# EAGLE design ESPMDIR (EAGLE 7.7.0)
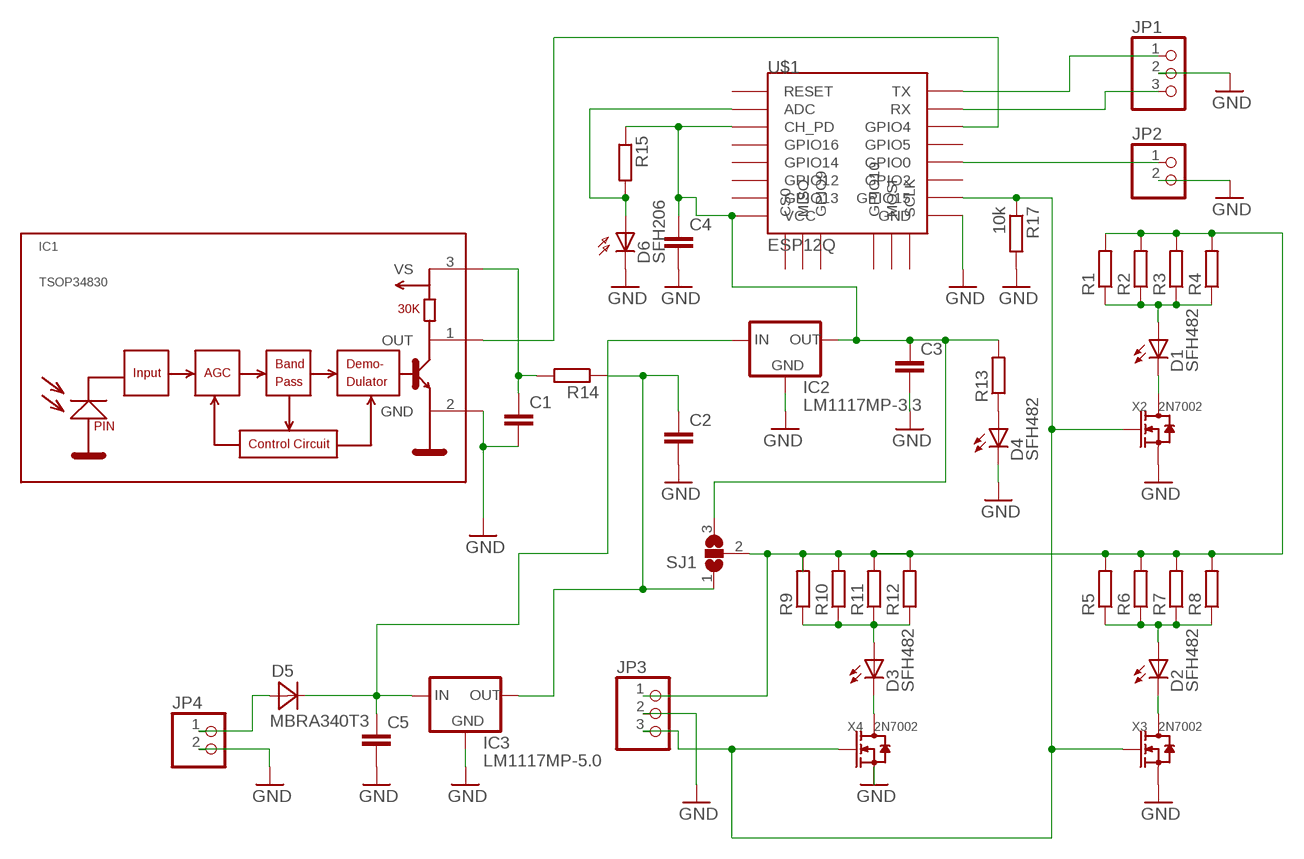
[diagram p0: schematic, sheet 1]

## Parts
C1  C-EUC4532  [C4532]
C2  C-EUC4532  [C4532]
C3  C-EUC4532  [C4532]
C4  C-EUC0805  [C0805]
C5  C-EUC4532  [C4532]
D1  SFH482  [SFH482]
D2  SFH482  [SFH482]
D3  SFH482  [SFH482]
D4  SFH482  [SFH482]
D5  MBRA340T3  [SMA]
D6  SFH206  [SFH206]
IC1  TSOP34830  [TSOP348]
IC2  LM1117MP-3.3  [SOT223]
IC3  LM1117MP-5.0  [SOT223]
JP1  PINHD-1X3  [1X03]
JP2  PINHD-1X2  [1X02]
JP3  PINHD-1X3  [1X03]
JP4  PINHD-1X2  [1X02]
R1  R-EU_R0805  [R0805]
R2  R-EU_R0805  [R0805]
R3  R-EU_R0805  [R0805]
R4  R-EU_R0805  [R0805]
R5  R-EU_R0805  [R0805]
R6  R-EU_R0805  [R0805]
R7  R-EU_R0805  [R0805]
R8  R-EU_R0805  [R0805]
R9  R-EU_R0805  [R0805]
R10  R-EU_R0805  [R0805]
R11  R-EU_R0805  [R0805]
R12  R-EU_R0805  [R0805]
R13  R-EU_R0805  [R0805]
R14  R-EU_R0805  [R0805]
R15  R-EU_R0805  [R0805]
R17  10k  R-EU_R0805  [R0805]
SJ1  SJ2W  [SJ_2]
U$1  ESP12Q  [ESP12Q]
X2  2N7002  SMD-MOSFET-N-CH-60V-300MA-LOGIC-LEVEL-FET-2N7002(SOT-23)  [SOT-23]
X3  2N7002  SMD-MOSFET-N-CH-60V-300MA-LOGIC-LEVEL-FET-2N7002(SOT-23)  [SOT-23]
X4  2N7002  SMD-MOSFET-N-CH-60V-300MA-LOGIC-LEVEL-FET-2N7002(SOT-23)  [SOT-23]

## Nets
N$1: D1.K(C) X2.3(D)
N$2: R9.2 R10.2 R11.2 R12.2
N$3: D3.A R9.1 R10.1 R11.1 R12.1
N$4: D2.K(C) X3.3(D)
N$5: C3.1 C4.1 IC2.2(OUT) IC2.4(OUT) R13.2 R15.1 SJ1.3 U$1.CH_PD U$1.VCC
N$6: D1.A R1.1 R2.1 R3.1 R4.1
N$7: D2.A R5.1 R6.1 R7.1 R8.1
N$8: D3.K(C) X4.3(D)
N$9: JP3.3 R17.1 U$1.GPIO15 X2.1(G) X3.1(G) X4.1(G)
N$10: C2.1 IC3.2(OUT) IC3.4(OUT) R14.1 SJ1.1
N$11: JP1.1 U$1.TX
N$12: JP3.1 R1.2 R2.2 R3.2 R4.2 R5.2 R6.2 R7.2 R8.2 SJ1.2
N$13: JP1.3 U$1.RX
N$14: JP2.1 U$1.GPIO0
N$15: D4.A R13.1
N$16: C1.1 IC1.3(VS) R14.2
N$17: IC1.1(OUT) U$1.GPIO4
N$19: C1.2 C2.2 C3.2 C4.2 C5.2 D4.K(C) D6.K(C) IC1.2(GND) IC2.1(GND) IC3.1(GND) JP1.2 JP2.2 JP3.2 JP4.2 R17.2 U$1.GND X2.2(S) X3.2(S) X4.2(S) ; supply symbol labelled GND
N$27: D5.A JP4.1
N$29: C5.1 D5.C IC2.3(IN) IC3.3(IN)
N$33: D6.A R15.2 U$1.ADC
Unconnected: U$1.CS0 U$1.GPIO2 U$1.GPIO5 U$1.GPIO9 U$1.GPIO10 U$1.GPIO12 U$1.GPIO13 U$1.GPIO14 U$1.GPIO16 U$1.MISO U$1.MOSI U$1.RESET U$1.SCLK

## Library data of the parts
C1-C5 = rcl:C-EU: CAPACITOR, European symbol
D1-D4 = led:SFH482: IR LED infrared emitting diode, Infineon
D5 = diode:MBRA340T3: Surface Mount Schottky Power Rectifier Source: http://www.onsemi.com/pub_link/Collateral/MBRA340T3-D.PDF
D6 = opto-trans-siemens:SFH206: PHOTO DIODE; MPN: SFH206K; OC_FARNELL: 1212741; OC_NEWARK: 01M8807
IC1 = vishay-1:TSOP348*: IR Receiver Modules for Remote Control Systems http://www.vishay.com/ir-receiver-modules/
IC2 = lm1117_11:LM1117?-*: 800mA Low-Dropout Linear Regulator Source: http://www.ti.com/lit/ds/symlink/lm1117-n.pdf; MF: Texas Instruments; MPN: LM1117MP-3.3; OC_FARNELL: 9778195; OC_NEWARK: 28X3416
IC3 = lm1117_11:LM1117?-*: 800mA Low-Dropout Linear Regulator Source: http://www.ti.com/lit/ds/symlink/lm1117-n.pdf; MF: Texas Instruments; MPN: LM1117MP-5.0; OC_FARNELL: 9778209; OC_NEWARK: 28X3417
JP1 JP3 = pinhead:PINHD-1X3: PIN HEADER
JP2 JP4 = pinhead:PINHD-1X2: PIN HEADER
R1-R15 R17 = rcl:R-EU_: RESISTOR, European symbol
SJ1 = jumper:SJ2W: SMD solder JUMPER
U$1 = esp826612q:ESP12Q: ESP8266 Wifi module 12-Q
X2-X4 = Seeed-OPL-Transistor:SMD-MOSFET-N-CH-60V-300MA-LOGIC-LEVEL-FET-2N7002(SOT-23): 305030028; MPN: 2N7002,215

## Board
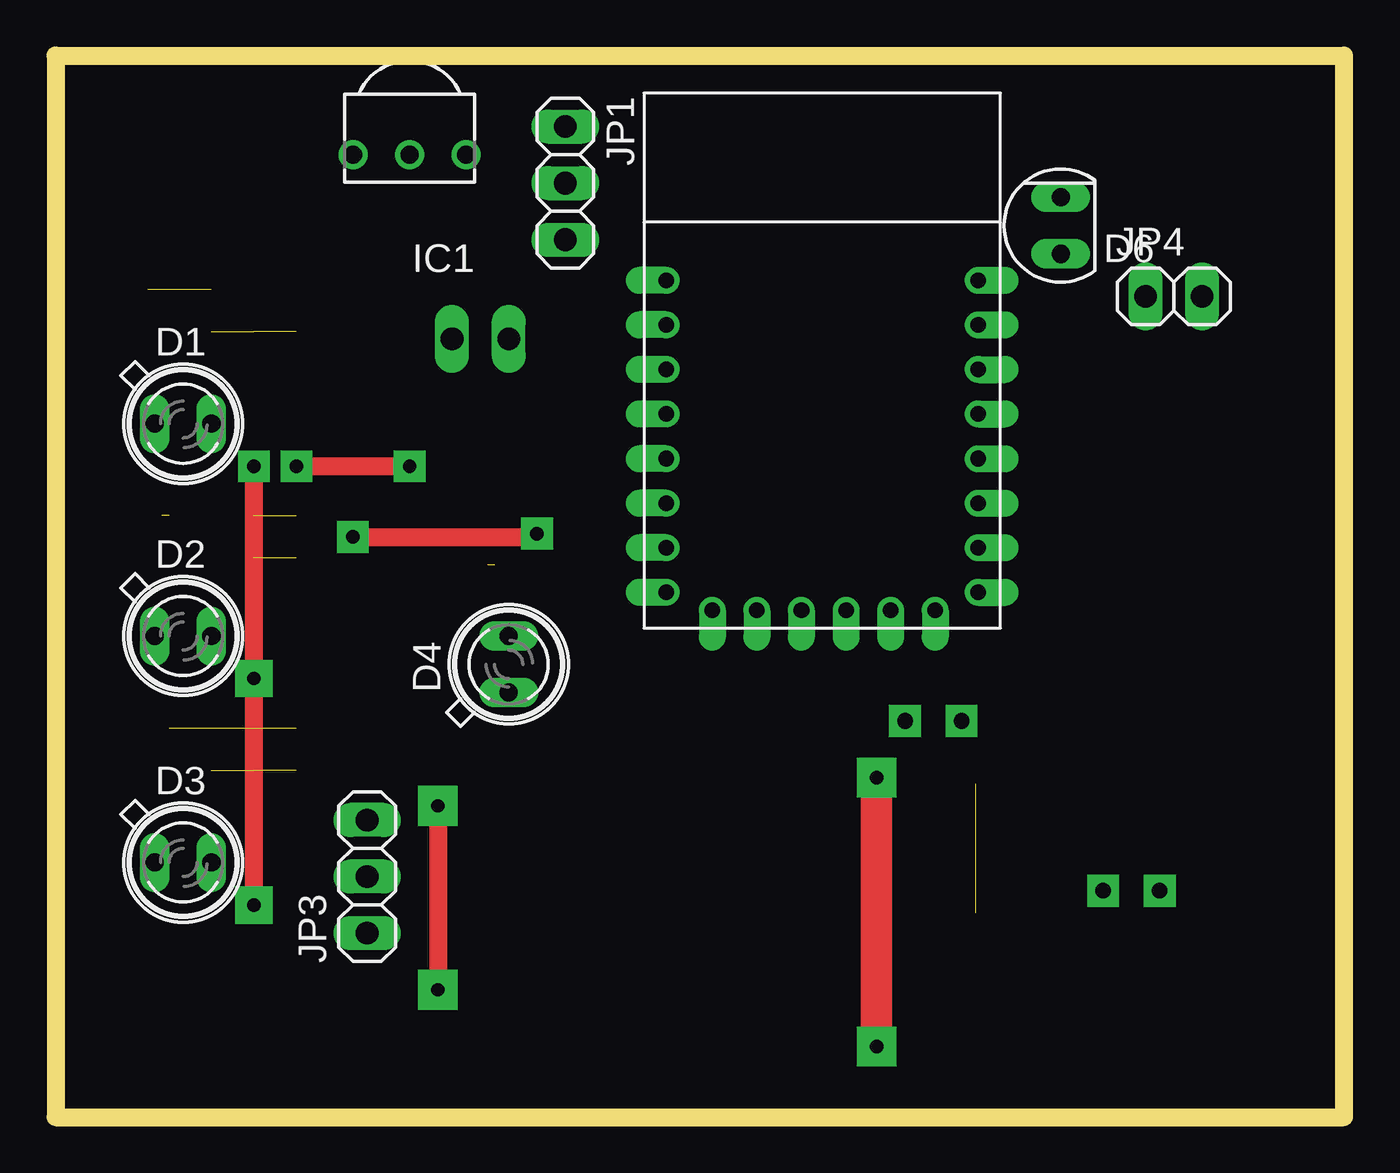
[diagram p1: board, top side]
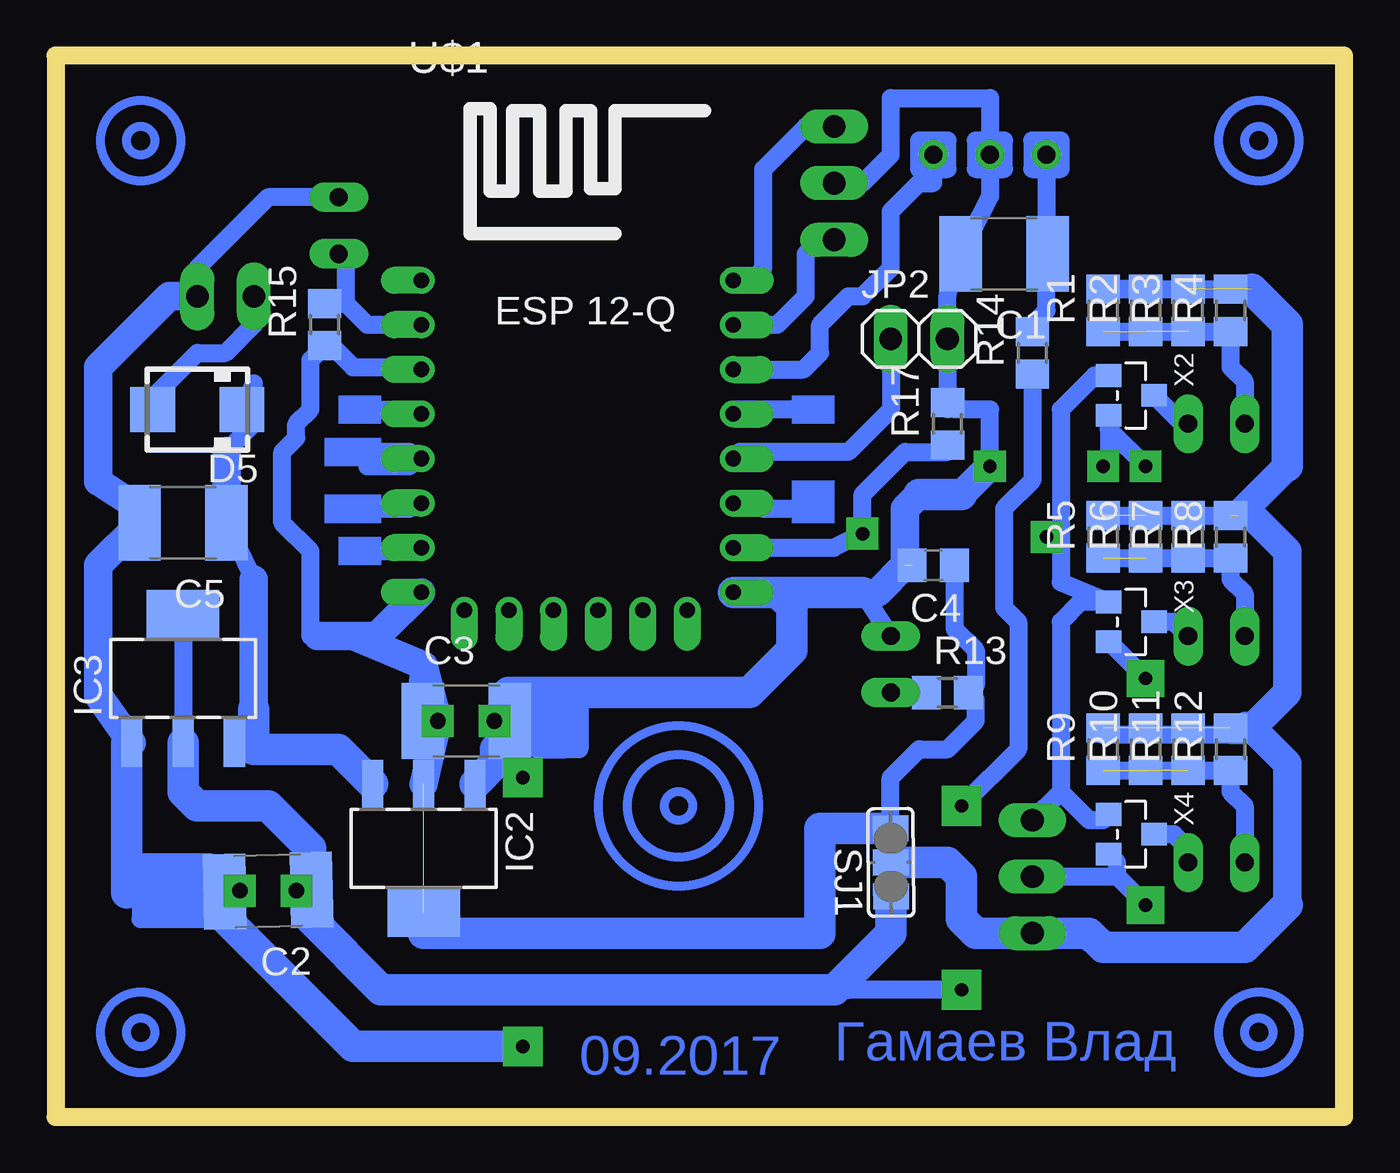
[diagram p2: board, bottom side, seen from below]

Size 57.79 x 47.62 mm. Coordinates in mm from the lower left corner, seen from the top.
Outline: 0,47.62 57.79,47.62 57.79,0 0,0 0,47.62
Copper layers (1*16): Top 0.035mm / dielectric 1.5mm / Bottom 0.035mm
Design rules "default *": minimum track width 32mil, minimum drill 24mil, track to track 24mil, track to pad 24mil, pad to pad 24mil, via to via 24mil, smd to smd 24mil, copper to edge 40mil, drill to drill 40mil, minimum pad ring 10mil, minimum via ring 8mil, stop-mask expansion 4mil, vias tented up to drill 0mil, thermal gap 10mil

### Footprints (pad centres in the part's own frame; a part is rotated, then mirrored left to right if it is on the bottom)
C4532 = smd 1.9 x 3.4: 1 -1.95,0; 2 1.95,0
C0805 = smd 1.3 x 1.5: 1 -0.95,0; 2 0.95,0
SFH482 = drill 0.813 long: A -1.27,0; K 1.27,0
SMA = smd 2 x 2: A 2,0; C -2,0
SFH206 = drill 0.813 long: A 0,-1.27; K 0,1.27
TSOP348 = drill 0.8: 1 -2.54,0; 2 0,0; 3 2.54,0
SOT223 = smd 0.95 x 2.15: 1 -2.3,-2.9; 2 0,-2.9; 3 2.3,-2.9 | smd 3.25 x 2.15: 4 0,2.9
1X03 = drill 1.016 long: 1 -2.54,0; 2 0,0; 3 2.54,0
1X02 = drill 1.016 long: 1 -1.27,0; 2 1.27,0
R0805 = smd 1.3 x 1.5: 1 -0.95,0; 2 0.95,0
SJ_2 = smd 1.168 x 1.6: 1 -1.524,0; 2 0,0; 3 1.524,0
ESP12Q = drill 0.7 offset: ADC -7.1,3.8; CH_PD -7.1,1.8; CS0 -5.165,-9.005; GND 6.9,-8.2; GPIO0 6.9,-2.2; GPIO2 6.9,-4.2; GPIO4 6.9,1.8; GPIO5 6.9,-0.2; GPIO9 -1.165,-9.005; GPIO10 0.835,-9.005; GPIO12 -7.1,-4.2; GPIO13 -7.1,-6.2; GPIO14 -7.1,-2.2; GPIO15 6.9,-6.2; GPIO16 -7.1,-0.2; MISO -3.165,-9.005; MOSI 2.835,-9.005; RESET -7.1,5.8; RX 6.9,3.8; SCLK 4.835,-9.005; TX 6.9,5.8; VCC -7.1,-8.2
SOT-23 = smd 1.016 x 1.143: 1 -0.889,-1.016; 2 0.889,-1.016; 3 0,1.016

### Placement (x,y rotation side)
C1  15.24,38.73 180 bottom
C2  48.26,10.16 181.2 bottom
C3  39.37,17.78 0 bottom
C4  18.41,24.76 180 bottom
C5  52.07,26.67 180 bottom
D1  5.72,31.11 0 top
D2  5.72,21.59 0 top
D3  5.72,11.43 0 top
D4  20.32,20.32 90 top
D5  51.44,31.75 180 bottom
D6  45.09,40 0 top
IC1  15.88,43.18 180 top
IC2  41.28,12.07 180 bottom
IC3  52.07,19.68 0 bottom
JP1  22.86,41.91 270 top
JP2  19.05,34.92 0 bottom
JP3  13.97,10.79 90 top
JP4  50.16,36.83 0 top
R1  10.79,36.19 90 bottom
R2  8.89,36.19 90 bottom
R3  6.99,36.19 90 bottom
R4  5.08,36.19 90 bottom
R5  10.79,26.04 90 bottom
R6  8.89,26.04 90 bottom
R7  6.99,26.04 90 bottom
R8  5.08,26.04 90 bottom
R9  10.79,16.51 90 bottom
R10  8.89,16.51 90 bottom
R11  6.99,16.51 90 bottom
R12  5.08,16.51 90 bottom
R13  17.78,19.05 0 bottom
R14  13.97,34.29 90 bottom
R15  45.72,35.56 90 bottom
R17  17.78,31.11 90 bottom
SJ1  20.32,11.43 90.5 bottom
U$1  34.29,31.75 0 bottom
X2  9.52,32.39 270 bottom
X3  9.52,22.22 270 bottom
X4  9.52,12.7 270 bottom

### Tracks (layer width: path | path; a pad name or v marks a point on that pad's centre or on a via)
N$1
  Bottom 0.813: D1.K 7.24,31.11 X2.3
N$2  (3 unrouted)
N$3  (2 unrouted)
  Bottom 0.813: R9.1 R12.1 5.08,14.61 4.44,13.97 D3.A
N$4
  Bottom 0.813: D2.K 7.62,22.22 X3.3
N$5  (via drill 0.7 pad 1.42)  (1 unrouted)
  Bottom 0.813: C4.1 17.46,21.91 16.51,20.96 16.51,19.37 R13.2 | R13.2 16.83,18.73 | SJ1.3 20.33,15.23 19.05,16.51 17.78,16.51 16.51,17.78 16.51,18.73 R13.2 | U$1.CH_PD 41.5,33.66 44.45,33.66 45.41,34.61 R15.1 46.36,33.97 46.36,31.75 46.99,31.11 46.99,30.48 47.62,29.85 47.62,26.67 46.36,25.4 46.36,21.59 46.04,21.59
  Bottom 1.27: 46.04,21.59 44.45,21.59 | U$1.VCC 43.18,21.76 43.18,21.59 44.45,21.59 | IC2.2 v40.64,17.78 41.28,20.28 | 44.45,21.59 41.28,20.28 | 41.28,20.28 C3.1
  Bottom 1.422: SJ1.3 23.49,12.95 23.49,8.25 41.28,8.25 IC2.4
N$6  (2 unrouted)
  Bottom 0.813: R1.1 R4.1 5.08,33.66 4.44,33.02 D1.A
N$7  (1 unrouted)
  Bottom 0.813: R7.1 R8.1 | R5.1 R8.1 | R8.1 5.08,24.13 4.44,23.5 D2.A
N$8
  Bottom 0.813: D3.K 6.99,12.07 7.62,12.7 X4.3
N$9  (via drill 0.6 pad 1.42)
  Top 0.813: v13.33,26.04 21.59,26.04 v21.59,26.18
  Bottom 0.813: U$1.GPIO15 22.86,25.55 v21.59,26.18 21.59,27.94 19.68,29.85 17.78,29.85 R17.1 | X2.1 11.18,33.27 12.7,31.75 12.7,26.04 | 12.7,26.04 12.7,24 X3.1 11.81,23.11 12.7,22.22 12.7,14.61 | 12.7,26.04 v13.33,26.04 | 12.7,14.61 11.43,13.33 10.79,13.33 X4.1 | JP3.3 12.7,14.61
N$10  (via drill 0.6 pad 1.78)
  Top 0.813: v17.14,13.97 v17.14,5.71
  Bottom 0.813: IC3.4 IC3.2 | R14.1 13.97,28.57 15.24,27.3 15.24,22.86 14.61,22.22 14.61,16.51 v17.14,13.97 | v17.14,5.71 22.22,5.71 22.54,6.03
  Bottom 1.422: IC3.2 52.07,14.61 51.44,13.97 48.26,13.97 46.36,12.07 46.36,10.25 C2.1 46.31,8.85 43.18,5.71 22.86,5.71 22.54,6.03 20.32,8.25 20.32,9.89 SJ1.1
N$11
  Bottom 0.813: U$1.TX 26.58,37.55 26.04,38.1 26.04,42.55 24.13,44.45 JP1.1
N$12  (4 unrouted)
  Bottom 0.813: R2.2 R1.2 4.12,37.14 | R7.2 R8.2 | 4.76,26.99 R5.2 4.12,26.99 | 3.81,17.78 4.44,17.78 5.08,17.14 | 5.08,17.14 10.79,17.14 | 5.08,17.14 3.81,17.14
  Bottom 1.27: 2.54,29.21 4.76,26.99 | 4.12,26.99 2.54,25.4 2.54,19.05 3.81,17.78 | 3.81,17.14 2.54,15.87 2.54,9.53
  Bottom 1.422: 4.12,37.14 2.54,35.56 2.54,29.21 | 2.54,9.53 4.44,7.62 10.79,7.62 11.43,8.25 JP3.1 16.51,8.25 17.14,8.89 17.14,10.79 17.78,11.43 SJ1.2
N$13
  Bottom 0.813: U$1.RX 25.41,35.55 24.13,36.83 24.13,38.73 23.49,39.37 JP1.3
N$14
  Bottom 0.813: JP2.1 20.32,31.75 22.22,29.85 27.1,29.85 U$1.GPIO0
N$15
  Bottom 0.813: D4.A R13.1
N$16
  Bottom 0.813: IC1.3 13.33,38.78 C1.1 13.33,37.42 13.33,36.19 13.97,35.56 R14.2
N$17
  Bottom 0.813: U$1.GPIO4 24.23,33.55 23.49,34.29 23.49,35.56 22.22,36.83 21.59,36.83 20.32,38.1 20.32,40.64 19.05,41.91 18.41,41.91 IC1.1
N$18
  Bottom 0.813: 24.13,31.75 27.3,31.75
N$19  (via drill 0.6 pad 1.42, 0.6 pad 1.68, 0.6 pad 1.78)  (1 unrouted)
  Top 0.813: v8.89,29.21 v8.89,19.68 v8.89,9.53 | v10.79,29.21 v15.88,29.21
  Top 1.422: v36.83,3.18 v36.83,15.24
  Bottom 0.406: IC3.1 54.61,16.79 | 38.05,16.52 C3.2
  Bottom 0.813: 36.2,18.42 36.2,16.51 35.56,16.51 | 15.88,43.81 16.51,43.81 16.51,42.55 15.24,42.55 15.24,43.81 15.88,43.81 | JP1.2 21.59,41.91 20.32,43.18 20.32,45.72 15.88,45.72 15.88,43.81 | 15.88,43.81 IC1.2 15.88,41.32 C1.2 17.78,36.88 JP2.2 R17.2 | 17.78,31.75 R17.2 | 20.9,23.55 21.59,23.55 D4.K | v15.88,29.21 15.88,31.75 17.46,31.75 R17.2 | v8.89,29.21 10.54,30.86 X2.2 10.54,29.46 v10.79,29.21 | v8.89,19.68 X3.2 | v8.89,9.53 10.16,10.79 | 10.16,10.79 10.16,11.43 X4.2 | JP3.2 10.16,10.79 | 54.02,27.3 C5.2 54.02,26.62 | D6.K 48.26,41.27 51.44,38.1 JP4.2 | 35.56,19.05 35.56,16.51 | 35.56,16.51 34.93,16.51 | 34.93,16.51 34.93,19.05 | 33.66,19.05 34.29,19.05 34.29,16.51 34.93,16.51
  Bottom 1.27: 20.9,23.55 19.68,24.76 19.68,27.3 19.05,27.94 | 17.14,27.94 v15.88,29.21 | 54.02,26.62 55.88,24.76 55.88,18.93 IC3.1 | 54.02,27.3 55.88,28.53 55.88,33.66 52.71,36.83 JP4.2
  Bottom 1.422: U$1.GND 25.4,23.55 | 25.4,23.55 21.59,23.55 | 19.05,27.94 17.14,27.94 | 54.61,16.79 54.61,10.07 C2.2 50.21,8.93 44.45,3.18 v36.83,3.18 | IC2.1 38.05,15.89 38.05,16.52 36.83,15.29 v36.83,15.24 | C3.2 37.42,18.37 37.47,18.42 37.47,19.05 35.56,19.05 34.93,19.05 33.66,19.05 26.67,19.05 24.76,20.96 24.76,22.92 25.4,23.55
N$20
  Bottom 0.813: 26.04,27.3 24.13,27.3
N$21
  Bottom 0.813: 43.82,25.4 41.28,25.4
N$22
  Bottom 0.813: 43.82,27.3 41.91,27.3
N$23
  Bottom 0.813: 43.82,29.21 41.91,29.21 41.91,29.85 43.82,29.85 43.82,29.21
N$24
  Bottom 0.813: 43.82,31.75 41.91,31.75
N$25
  Bottom 0.813: 12.7,43.81 13.97,43.81 13.97,42.55 12.7,42.55 12.7,43.81
N$26  (via drill 0.7 pad 1.42)
  Bottom 0.813: 52.71,11.43 52.71,8.89 53.34,8.89 53.34,11.43 | 53.34,11.43 53.98,11.43 53.98,8.89 50.8,8.89 v49.53,10.16 50.8,11.43 53.34,11.43
N$27
  Bottom 0.813: D5.A 53.44,32.29 51.44,34.29 50.16,34.29 48.9,35.56 JP4.1
N$28
  Bottom 0.813: 17.78,43.81 19.05,43.81 19.05,42.55 17.78,42.55 17.78,43.81
N$29
  Bottom 0.813: C5.1 50.12,26.62 48.9,24.13 | 48.9,18.29 IC3.3 | 50.12,29.89 48.9,31.11 48.9,32.92 D5.C
  Bottom 1.27: 48.9,24.13 48.9,18.29 | C5.1 50.12,29.89
  Bottom 1.422: 48.9,18.29 48.9,16.51 45.12,16.51 IC2.3
N$30
  Bottom 0.813: 51.44,11.43 51.44,8.89 52.07,8.89 52.07,11.43
N$31  (via drill 0.7 pad 1.42)
  other vias: 38.1,17.78
N$32  (via drill 0.7 pad 1.42)
  other vias: 46.99,10.16
N$33
  Bottom 0.813: R15.2 44.77,36.51 | 44.77,36.51 43.82,35.56 U$1.ADC | 44.77,36.51 44.77,38.41 D6.A
(copper drawn outside any net)
  shapes: Bottom area x10, Bottom circle x11

### Text on the board
Bottom: Гамаев Влад | 09.2017